# Altium schematic sheet breakout-1.SchDoc
size Letter
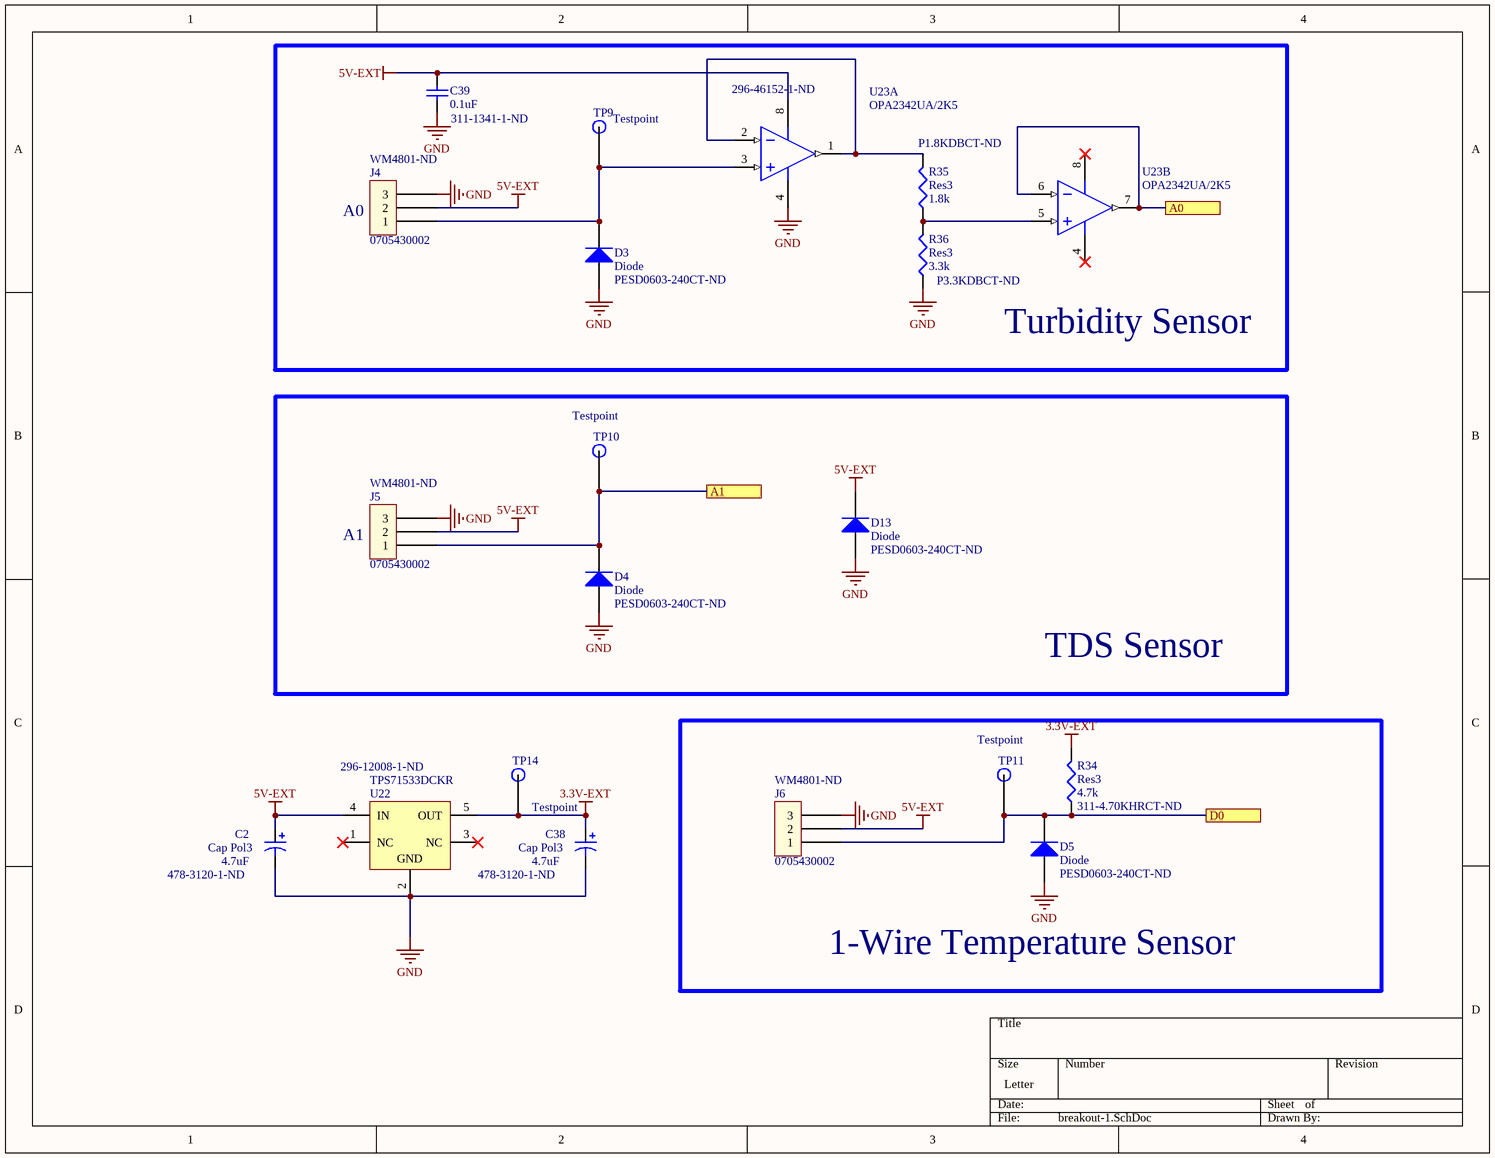
[diagram p0: breakout-1.SchDoc]

## Parts
C2  Cap Pol3  value 4.7uF  Supplier Part Number 1: 478-3120-1-ND  [1206-pol]
C38  Cap Pol3  value 4.7uF  Supplier Part Number 1: 478-3120-1-ND  [1206-pol]
C39  value 0.1uF  Supplier Part Number 1: 311-1341-1-ND  [1608[0603]]  (hidden comment: Cap Semi)
D3  Diode  Supplier Part Number 1: PESD0603-240CT-ND  [J1-0603]
D4  Diode  Supplier Part Number 1: PESD0603-240CT-ND  [J1-0603]
D5  Diode  Supplier Part Number 1: PESD0603-240CT-ND  [J1-0603]
D13  Diode  Supplier Part Number 1: PESD0603-240CT-ND  [J1-0603]
J4  0705430002  Supplier Part Number 1: WM4801-ND  [0705430002]
J5  0705430002  Supplier Part Number 1: WM4801-ND  [0705430002]
J6  0705430002  Supplier Part Number 1: WM4801-ND  [0705430002]
R34  Res3  value 4.7k  Supplier Part Number 1: 311-4.70KHRCT-ND  [J1-0603]
R35  Res3  value 1.8k  Supplier Part Number 1: P1.8KDBCT-ND  [J1-0603]
R36  Res3  value 3.3k  Supplier Part Number 1: P3.3KDBCT-ND  [J1-0603]
TP9  Testpoint  [testpoint]  (no BOM)
TP10  Testpoint  [testpoint]  (no BOM)
TP11  Testpoint  [testpoint]  (no BOM)
TP14  Testpoint  [testpoint]  (no BOM)
U22  TPS71533DCKR  Supplier Part Number 1: 296-12008-1-ND  [DCK0005A_L]
U23  OPA2342UA/2K5  Supplier Part Number 1: 296-46152-1-ND  [D0008A_M]  (parts A,B of 2)

## Blocks framed on the sheet
Turbidity Sensor: C39 D3 J4 R35 R36 TP9 U23
TDS Sensor: D4 D13 J5 TP10
1-Wire Temperature Sensor: D5 J6 R34 TP11

## Ports
A0, A1, D0

## Nets
3.3V-EXT: C38.1 R34.2 TP14.1 U22.5(OUT)
5V-EXT: C2.1 C39.1 D13.2(K) J4.2 J5.2 J6.2 U22.4(IN) U23.8(V+)
GND: C2.2 C38.2 C39.2 D3.1(A) D4.1(A) D5.1(A) D13.1(A) J4.3 J5.3 J6.3 R36.1 U22.2(GND) U23.4(V-)
A0: U23.6(IN_B-) U23.7(OUT_B) ; port A0
A1: D4.2(K) J5.1 TP10.1 ; port A1
D0: D5.2(K) J6.1 R34.1 TP11.1 ; port D0
NetD3_2: D3.2(K) J4.1 TP9.1 U23.3(IN_A+)
NetR35_1: R35.1 R36.2 U23.5(IN_B+)
NetR35_2: R35.2 U23.1(OUT_A) U23.2(IN_A-)

Not connected (* = marked no-connect by the designer): U22 1(NC)* 3(NC)*

## Notes on the sheet
- (near J4) A0
- (near J5) A1

## Library data of the parts
C2 C38 = Cap Pol3: Polarized Capacitor (Surface Mount); Manufacturer: AVX Corporation; Manufacturer Part Number: NOJA475M010RWJ; Manufacturer Size Code: A; Tolerance: ±20%; Dissipation Factor: 6%; Supplier 1: Digi-Key; RoHS: RoHS Compliant; Category: Capacitors; Stock 1: 5356; Pricing 1: 1=0.68, 10=0.485, 100=0.319, 500=0.2363, 1000=0.20086 (CAD); Packaging: Cut Tape (CT); Part Status: Active; Mounting Type: Surface Mount; Package / Case: 1206 (3216 Metric); Height - Seated (Max): 0.071" (1.80mm); Features: -; Operating Temperature: -55°C ~ 105°C; Supplier Device Package: 1206 (3216 Metric); Size / Dimension: 0.126" L x 0.063" W (3.20mm x 1.60mm); ComponentLink1URL: http://datasheets.avx.com/NOJ.pdf; ComponentLink1Description: http://datasheets.avx.com/NOJ.pdf
C39 = Cap Semi: Capacitor (Semiconductor SIM Model); Manufacturer: Yageo; Manufacturer Part Number: CC0603KRX7R8BB104; Capacitance: 100nF; Tolerance: 10%; Voltage Rating: 25V; Dielectric: X7R; ComponentLink1URL: http://www.samsungsem.com/servlet/FileDownload?type=spec&file=CL10B104KB8NNNC.pdf; ComponentLink1Description: http://www.samsungsem.com/servlet/FileDownload?type=spec&file=CL10B104KB8NNNC.pdf; Supplier 1: Digi-Key; Stock 1: 22812167; Pricing 1: 1=0.10000, 10=0.05000, 100=0.02220, 500=0.01584, 1000=0.01245 (USD); RoHS: Yes; Mount: Surface Mount; Case/Package: 0603; Number of Pins: 2; Case Code (Imperial): 0603; Case Code (Metric): 1608; Min Operating Temperature: -55°C; Max Operating Temperature: 125°C; Packaging: Tape and Reel; Package Quantity: 1; Voltage Rating (DC): 25V; Termination: SMD/SMT; Composition: Ceramic; Voltage: 25V; Length: 1.6mm; Height: 0.8mm; Width: 0.8mm; Thickness: 0.035inch; Depth: 0.8mm; Radiation Hardening: No; REACH SVHC: Unknown; Lead Free: Lead Free; Halogen Free: Halogen Free; ComponentLink2URL: https://datasheet.ciiva.com/11786/0900766b80c10176-11786120.pdf?src-supplier=RSComponents; ComponentLink2Description: https://datasheet.ciiva.com/11786/0900766b80c10176-11786120.pdf?src-supplier=RSComponents; ComponentLink3URL: https://datasheet.ciiva.com/144/mlccorderingcode-144075.pdf?src-supplier=Digi-Key; ComponentLink3Description: https://datasheet.ciiva.com/144/mlccorderingcode-144075.pdf?src-supplier=Digi-Key; ComponentLink4URL: https://datasheet.ciiva.com/17434/upy-gphc-x7r-6-3v-to-50v-8-17434263.pdf?src-supplier=Avnet+Europe; ComponentLink4Description: https://datasheet.ciiva.com/17434/upy-gphc-x7r-6-3v-to-50v-8-17434263.pdf?src-supplier=Avnet+Europe; ComponentLink5URL: https://datasheet.ciiva.com/26829/getdatasheetpartid-403577-26829431.pdf?src-supplier=Verical; ComponentLink5Description: https://datasheet.ciiva.com/26829/getdatasheetpartid-403577-26829431.pdf?src-supplier=Verical; ComponentLink6URL: https://datasheet.ciiva.com/11587/upy-gphc-x7r-6-3v-to-50v-8-11587208.pdf?src-supplier=Avnet; ComponentLink6Description: https://datasheet.ciiva.com/11587/upy-gphc-x7r-6-3v-to-50v-8-11587208.pdf?src-supplier=Avnet; ComponentLink7URL: https://datasheet.ciiva.com/13389/upy-gphc-x7r-6-3v-to-50v-8-13389352.pdf?src-supplier=Mouser; ComponentLink7Description: https://datasheet.ciiva.com/13389/upy-gphc-x7r-6-3v-to-50v-8-13389352.pdf?src-supplier=Mouser; ComponentLink8URL: https://datasheet.ciiva.com/28450/1489800-28450584.pdf?src-supplier=Element14; ComponentLink8Description: https://datasheet.ciiva.com/28450/1489800-28450584.pdf?src-supplier=Element14; ComponentLink9URL: https://datasheet.ciiva.com/144/mlccorderingcode-144073.pdf?src-supplier=Digi-Key; ComponentLink9Description: https://datasheet.ciiva.com/144/mlccorderingcode-144073.pdf?src-supplier=Digi-Key; ComponentLink10URL: https://datasheet.ciiva.com/144/mlccorderingcode-144074.pdf?src-supplier=Digi-Key; ComponentLink10Description: https://datasheet.ciiva.com/144/mlccorderingcode-144074.pdf?src-supplier=Digi-Key; ComponentLink11URL: https://datasheet.ciiva.com/7978/1489800-7978155.pdf?src-supplier=Element14; ComponentLink11Description: https://datasheet.ciiva.com/7978/1489800-7978155.pdf?src-supplier=Element14
D3-D5 D13 = Diode: Default Diode; Manufacturer: Littelfuse; Manufacturer Part Number: RF1256-000; Clamping Voltage: 45V; Reverse Standoff Voltage: 24V; Power Line Protection: No; Number of Bidirectional Channels: 1; Published: 8-Jun-2000; LatestRevisionDate: 17-Jul-2002; LatestRevisionNote: Re-released for DXP Platform.; PackageVersion: Sep-1996; PackageReference: SMC; Publisher: Altium Limited; PackageDescription: DO-214-AB/SMC; 2 C-Bend Leads; Body 7.9 x 5.9 mm, inc. leads (LxW); Code_JEDEC: DO-214-AB; Supplier 1: Digi-Key; Stock 1: 74186; Pricing 1: 1 = 0.58000, 10 = 0.45300, 25 = 0.38200, 100 = 0.31080, 250 = 0.25752, 500 = 0.21312, 1000 = 0.15984, 2500 = 0.14652 (USD); RoHS: Yes; Mount: Surface Mount; Case/Package: 0603; Case Code (Metric): 1608; Case Code (Imperial): 0603; Min Operating Temperature: -55°C; Max Operating Temperature: 125°C; Packaging: Tape and Reel; Composition: Zener; ComponentLink1URL: http://www.littelfuse.com/~/media/electronics/datasheets/polymer_esd_suppressors/littelfuse_polymer_esd_suppressor_pesd_catalog_datasheet.pdf.pdf?src-supplier=Digi-Key; ComponentLink1Description: http://www.littelfuse.com/~/media/electronics/datasheets/polymer_esd_suppressors/littelfuse_polymer_esd_suppressor_pesd_catalog_datasheet.pdf.pdf?src-supplier=Digi-Key
J4-J6 = 0705430002: Manufacturer: Molex; Manufacturer Part Number: 70543-0002; Number of Positions: 3; Contact Resistance: 30mR; Gender: Male; Current Rating: 3A; Voltage Rating: 250V; Pitch: 2.54mm; Approvals: UL; Glow Wire Compliant: Non-compliant; Supplier 1: Digi-Key; Stock 1: 32342; Pricing 1: 1 = 0.92000, 10 = 0.80500, 100 = 0.69450, 500 = 0.56826, 2496 = 0.45776, 7488 = 0.44198, 12480 = 0.41041 (USD); RoHS: Yes; Mount: Through Hole; Color: Black; Housing Color: Black; Housing Material: Thermoplastic; Contact Material: Bronze; Contact Plating: Gold; Material: Brass; Min Operating Temperature: -40°C; Max Operating Temperature: 105°C; Number of Rows: 1; Packaging: Rail/Tube; Termination: Solder; Orientation: Vertical; Package Quantity: 2496; Number of Contacts: 3; Max Current Rating: 3A; Max Voltage Rating (AC): 250V; Number of Circuits: 3; Voltage Rating (DC): 250V; Length: 10.17mm; Height: 11.81mm; Depth: 6.6mm; Lead Pitch: 2.54mm; Radiation Hardening: No; REACH SVHC: Unknown; ELV: Compliant; Lead Free: Lead Free; Flammability Rating: UL94 V-0; ComponentLink1URL: https://datasheet.ciiva.com/11747/0900766b80d8d64b-11747399.pdf?src-supplier=RSComponents; ComponentLink1Description: https://datasheet.ciiva.com/11747/0900766b80d8d64b-11747399.pdf?src-supplier=RSComponents; ComponentLink2URL: https://datasheet.ciiva.com/30061/97290705430002-pcb-headers-30061900.pdf?src-supplier=Onlinecomponents.com; ComponentLink2Description: https://datasheet.ciiva.com/30061/97290705430002-pcb-headers-30061900.pdf?src-supplier=Onlinecomponents.com; ComponentLink3URL: https://datasheet.ciiva.com/19462/884643-19462365.pdf?src-supplier=Jameco; ComponentLink3Description: https://datasheet.ciiva.com/19462/884643-19462365.pdf?src-supplier=Jameco; ComponentLink4URL: https://datasheet.ciiva.com/5150/0705430002-pcb-headers-172733-5150622.pdf?src-supplier=Mouser; ComponentLink4Description: https://datasheet.ciiva.com/5150/0705430002-pcb-headers-172733-5150622.pdf?src-supplier=Mouser; ComponentLink5URL: https://datasheet.ciiva.com/16657/0705430002-pcb-headers-16657766.pdf?src-supplier=Avnet+Europe; ComponentLink5Description: https://datasheet.ciiva.com/16657/0705430002-pcb-headers-16657766.pdf?src-supplier=Avnet+Europe
R34 = Res3: Resistor; Manufacturer: Yageo; Manufacturer Part Number: RC0603FR-074K7L; Tolerance: 1%; Resistance: 4.7kR; Temperature Coefficient: 100ppm/°C; Power Rating: 100mW; Voltage Rating (DC): 50V; Published: 8-Jun-2000; LatestRevisionDate: 29-May-2009; LatestRevisionNote: IPC-7351 Footprint Added.; PackageReference: J1-0603; Publisher: Altium Limited; PackageDescription: Chip Resistor; Supplier 1: Digi-Key; Stock 1: 18304102; Pricing 1: 1 = 0.10000, 10 = 0.02400, 100 = 0.00970, 1000 = 0.00437, 2500 = 0.00379 (USD); RoHS: Yes; Case/Package: 0603; Number of Pins: 2; Case Code (Imperial): 0603; Case Code (Metric): 1608; Min Operating Temperature: -55°C; Max Operating Temperature: 155°C; Composition: Thick Film; Packaging: Tape and Reel; Voltage Rating: 50V; Termination: SMD/SMT; Military Standard: Not; Length: 1.6mm; Height: 0.45mm; Width: 0.8mm; Depth: 0.8mm; Lead Pitch: 0.3mm; REACH SVHC: No SVHC; Lead Free: Lead Free; ComponentLink1URL: https://datasheet.ciiva.com/15189/getdatasheetpartid-422754-15189760.pdf?src-supplier=Verical; ComponentLink1Description: https://datasheet.ciiva.com/15189/getdatasheetpartid-422754-15189760.pdf?src-supplier=Verical; ComponentLink2URL: https://datasheet.ciiva.com/22747/443971-22747528.pdf?src-supplier=Element14; ComponentLink2Description: https://datasheet.ciiva.com/22747/443971-22747528.pdf?src-supplier=Element14; ComponentLink3URL: https://datasheet.ciiva.com/7660/38590-7660794.pdf?src-supplier=Element14; ComponentLink3Description: https://datasheet.ciiva.com/7660/38590-7660794.pdf?src-supplier=Element14; ComponentLink4URL: https://datasheet.ciiva.com/7746/1868787-7746365.pdf?src-supplier=Element14; ComponentLink4Description: https://datasheet.ciiva.com/7746/1868787-7746365.pdf?src-supplier=Element14; ComponentLink5URL: https://datasheet.ciiva.com/46440/1868787-46440909.pdf?src-supplier=Element14; ComponentLink5Description: https://datasheet.ciiva.com/46440/1868787-46440909.pdf?src-supplier=Element14; ComponentLink6URL: https://datasheet.ciiva.com/7746/1738695-7746366.pdf?src-supplier=Element14; ComponentLink6Description: https://datasheet.ciiva.com/7746/1738695-7746366.pdf?src-supplier=Element14
R35 = Res3: Resistor; Manufacturer: Panasonic; Manufacturer Part Number: ERA3AEB182V; Resistance: 1.8kR; Power Rating: 100mW; Tolerance: 0.1%; Voltage Rating: 75V; Temperature Coefficient: 25ppm/°C; Published: 8-Jun-2000; LatestRevisionDate: 29-May-2009; LatestRevisionNote: IPC-7351 Footprint Added.; PackageReference: J1-0603; Publisher: Altium Limited; PackageDescription: Chip Resistor; Supplier 1: Digi-Key; Stock 1: 69670; Pricing 1: 1=0.35000, 10=0.30000, 100=0.11720, 1000=0.04906, 2500=0.04498 (USD); RoHS: Yes; Mount: Surface Mount; Case/Package: 0603; Number of Pins: 2; Case Code (Metric): 1608; Case Code (Imperial): 0603; Contact Plating: Tin; Min Operating Temperature: -55°C; Max Operating Temperature: 155°C; Packaging: Tape and Reel; Package Quantity: 1; Composition: Thin Film; Termination: SMD/SMT; Number of Terminations: 2; Military Standard: Not; Max Power Dissipation: 100mW; Voltage Rating (DC): 75V; Features: Automotive AEC-Q200; Length: 1.6mm; Height: 0.022inch; Width: 0.031inch; Depth: 0.8mm; Radiation Hardening: No; REACH SVHC: No SVHC; Lead Free: Lead Free; ComponentLink1URL: https://datasheet.ciiva.com/11808/0900766b80fe20f7-11808057.pdf?src-supplier=RSComponents; ComponentLink1Description: https://datasheet.ciiva.com/11808/0900766b80fe20f7-11808057.pdf?src-supplier=RSComponents; ComponentLink2URL: https://datasheet.ciiva.com/29183/450862-da-01-en-widerstand-0603-era-29183768.pdf?src-supplier=Conrad; ComponentLink2Description: https://datasheet.ciiva.com/29183/450862-da-01-en-widerstand-0603-era-29183768.pdf?src-supplier=Conrad; ComponentLink3URL: https://datasheet.ciiva.com/6000/485442-6000901.pdf?src-supplier=Farnell; ComponentLink3Description: https://datasheet.ciiva.com/6000/485442-6000901.pdf?src-supplier=Farnell; ComponentLink4URL: https://datasheet.ciiva.com/48425/era-eng-tds-48425432.pdf?src-supplier=Distrelec; ComponentLink4Description: https://datasheet.ciiva.com/48425/era-eng-tds-48425432.pdf?src-supplier=Distrelec; ComponentLink5URL: https://datasheet.ciiva.com/17214/aoa0000ce26-17214494.pdf?src-supplier=Avnet+Europe; ComponentLink5Description: https://datasheet.ciiva.com/17214/aoa0000ce26-17214494.pdf?src-supplier=Avnet+Europe; ComponentLink6URL: https://datasheet.ciiva.com/9197/aoa0000ce26-9197737.pdf?src-supplier=Avnet; ComponentLink6Description: https://datasheet.ciiva.com/9197/aoa0000ce26-9197737.pdf?src-supplier=Avnet; ComponentLink7URL: https://datasheet.ciiva.com/46422/485442-46422587.pdf?src-supplier=Element14; ComponentLink7Description: https://datasheet.ciiva.com/46422/485442-46422587.pdf?src-supplier=Element14; ComponentLink8URL: https://datasheet.ciiva.com/30218/54aoa0000ce26-30218060.pdf?src-supplier=Onlinecomponents.com; ComponentLink8Description: https://datasheet.ciiva.com/30218/54aoa0000ce26-30218060.pdf?src-supplier=Onlinecomponents.com; ComponentLink9URL: https://datasheet.ciiva.com/46422/485442-46422588.pdf?src-supplier=Element14; ComponentLink9Description: https://datasheet.ciiva.com/46422/485442-46422588.pdf?src-supplier=Element14; ComponentLink10URL: https://datasheet.ciiva.com/43455/485442-43455222.pdf?src-supplier=Farnell; ComponentLink10Description: https://datasheet.ciiva.com/43455/485442-43455222.pdf?src-supplier=Farnell; ComponentLink11URL: https://datasheet.ciiva.com/46422/485442-46422589.pdf?src-supplier=Element14; ComponentLink11Description: https://datasheet.ciiva.com/46422/485442-46422589.pdf?src-supplier=Element14
R36 = Res3: Resistor; Manufacturer: Panasonic; Manufacturer Part Number: ERA-3AEB332V; Tolerance: 0.1%; Resistance: 3.3kR; Temperature Coefficient: 25ppm/°C; Power Rating: 100mW; Voltage Rating: 75V; Published: 8-Jun-2000; LatestRevisionDate: 29-May-2009; LatestRevisionNote: IPC-7351 Footprint Added.; PackageReference: J1-0603; Publisher: Altium Limited; PackageDescription: Chip Resistor; Supplier 1: Digi-Key; Stock 1: 140800; Pricing 1: 1=0.35000, 10=0.30000, 100=0.11720, 1000=0.04906, 2500=0.04498 (USD); RoHS: Yes; Mount: Surface Mount; Case/Package: 0603; Number of Pins: 2; Contact Plating: Tin; Case Code (Imperial): 0603; Case Code (Metric): 1608; Min Operating Temperature: -55°C; Max Operating Temperature: 155°C; Composition: Metal Film; Packaging: Tape and Reel; Package Quantity: 1; Termination: SMD/SMT; Number of Terminations: 2; Military Standard: Not; Max Power Dissipation: 100mW; Voltage Rating (DC): 75V; Features: Automotive AEC-Q200; Length: 1.6mm; Height: 0.45mm; Width: 0.8mm; Depth: 0.8mm; Radiation Hardening: No; REACH SVHC: No SVHC; Lead Free: Lead Free; ComponentLink1URL: https://datasheet.ciiva.com/11808/0900766b80fe20f7-11808044.pdf?src-supplier=RSComponents; ComponentLink1Description: https://datasheet.ciiva.com/11808/0900766b80fe20f7-11808044.pdf?src-supplier=RSComponents; ComponentLink2URL: https://datasheet.ciiva.com/29183/450962-da-01-en-widerstand-0603-era-29183781.pdf?src-supplier=Conrad; ComponentLink2Description: https://datasheet.ciiva.com/29183/450962-da-01-en-widerstand-0603-era-29183781.pdf?src-supplier=Conrad; ComponentLink3URL: https://datasheet.ciiva.com/16783/70068849-16783127.pdf?src-supplier=Allied+Electronics; ComponentLink3Description: https://datasheet.ciiva.com/16783/70068849-16783127.pdf?src-supplier=Allied+Electronics; ComponentLink4URL: https://datasheet.ciiva.com/46397/485442-46397447.pdf?src-supplier=Element14; ComponentLink4Description: https://datasheet.ciiva.com/46397/485442-46397447.pdf?src-supplier=Element14; ComponentLink5URL: https://datasheet.ciiva.com/46397/485442-46397448.pdf?src-supplier=Element14; ComponentLink5Description: https://datasheet.ciiva.com/46397/485442-46397448.pdf?src-supplier=Element14; ComponentLink6URL: https://datasheet.ciiva.com/43455/485442-43455225.pdf?src-supplier=Farnell; ComponentLink6Description: https://datasheet.ciiva.com/43455/485442-43455225.pdf?src-supplier=Farnell; ComponentLink7URL: https://datasheet.ciiva.com/9196/aoa0000ce26-9196554.pdf?src-supplier=Avnet; ComponentLink7Description: https://datasheet.ciiva.com/9196/aoa0000ce26-9196554.pdf?src-supplier=Avnet; ComponentLink8URL: https://datasheet.ciiva.com/16395/aoa0000ce26-16395258.pdf?src-supplier=Future+Electronics; ComponentLink8Description: https://datasheet.ciiva.com/16395/aoa0000ce26-16395258.pdf?src-supplier=Future+Electronics; ComponentLink9URL: https://datasheet.ciiva.com/16785/70068849-16785020.pdf?src-supplier=Allied+Electronics; ComponentLink9Description: https://datasheet.ciiva.com/16785/70068849-16785020.pdf?src-supplier=Allied+Electronics; ComponentLink10URL: https://datasheet.ciiva.com/30210/54aoa0000ce26-30210940.pdf?src-supplier=Onlinecomponents.com; ComponentLink10Description: https://datasheet.ciiva.com/30210/54aoa0000ce26-30210940.pdf?src-supplier=Onlinecomponents.com; ComponentLink11URL: https://datasheet.ciiva.com/6137/485442-6137949.pdf?src-supplier=Farnell; ComponentLink11Description: https://datasheet.ciiva.com/6137/485442-6137949.pdf?src-supplier=Farnell; ComponentLink12URL: https://datasheet.ciiva.com/43457/485442-43457774.pdf?src-supplier=Farnell; ComponentLink12Description: https://datasheet.ciiva.com/43457/485442-43457774.pdf?src-supplier=Farnell; ComponentLink13URL: https://datasheet.ciiva.com/48530/era-eng-tds-48530478.pdf?src-supplier=Distrelec; ComponentLink13Description: https://datasheet.ciiva.com/48530/era-eng-tds-48530478.pdf?src-supplier=Distrelec
TP9-TP11 TP14 = SMT Testpoint
U22 = CMP-0394-00925-2: Single Output LDO, 50 mA, Fixed 3.3 V Output, 3 to 24 V Input, 5-pin SC70 (DCK), -40 to 85 degC, Green (RoHS & no Sb/Br); Manufacturer: Texas Instruments; Accuracy(%): 4; Vdo(Typ)(mV): 415; Vin(Min)(V): 3; Iq(Typ)(mA): 0.003; Fixed Output Options(V): 3.3; SubFamily: Single Channel LDO; Iout(Max)(A): 0.05; Vin(Max)(V): 24; Dropout Voltage: 415mV; Output Current: 50mA; Number of Outputs: 1; Output Voltage: 3.3V; Max Power Dissipation: 320mW; Max Input Voltage: 24V; Min Input Voltage: 3V; Min Current Limit: 125mA; Input Bias Current: 3.2uA; Polarity: Positive; Quiescent Current: 3uA; Accuracy: 4%; Min Supply Voltage: 2.5V; ComponentLink3Description: Package Specification; ComponentLink1URL: http://www.ti.com/; ComponentLink3URL: http://www.ti.com/litv/pdf/mpds025f; PackageDescription: 5-Pin Plastic Small-Outline, Body 2 x 1.25 mm, Pitch 0.65 mm; PartNumber: TPS71533DCKR; Vout Adj(Min)(V): 3.3; ComponentLink2URL: http://www.ti.com/general/docs/lit/getliterature.tsp?genericPartNumber=TPS71533&fileType=pdf; ComponentLink2Description: Datasheet; ComponentLink1Description: Manufacturer URL; Code_JEDEC: MO-203; Vout Adj(Max)(V): 3.3; Mounting Technology: Surface Mount; DatasheetVersion: SLVS338P; Eco-Plan: Green (RoHS & no Sb/Br); PackageVersion: 4093553-3/G; PackageReference: DCK0005A; Supplier 1: Digi-Key; Manufacturer Part Number: TPS71533DCKR; Stock 1: 159612; Pricing 1: 1 = 0.90000, 10 = 0.80200, 100 = 0.62540, 500 = 0.51664, 1000 = 0.40788 (USD); RoHS: Yes; Case/Package: SC; Number of Pins: 5; Min Operating Temperature: -40°C; Max Operating Temperature: 125°C; Package Quantity: 3000; Packaging: Tape and Reel; Power Rating: 320mW; Max Output Current: 50mA; Number of Regulators: 1; Min Output Voltage: 3.3V; Power Dissipation: 320mW; Output Voltage Accuracy: 4%; Max Output Voltage: 3.3V; Output Type: Fixed; Nominal Output Voltage: 3.3V; Termination: SMD/SMT; Current Rating: 50mA; Length: 2mm; Height: 0.9mm; Width: 1.25mm; Radiation Hardening: No; Lead Free: Lead Free; REACH SVHC: No SVHC; ComponentLink4URL: https://datasheet.ciiva.com/22700/1835023-22700176.pdf?src-supplier=Element14; ComponentLink4Description: https://datasheet.ciiva.com/22700/1835023-22700176.pdf?src-supplier=Element14; ComponentLink5URL: https://datasheet.ciiva.com/27051/1116751-27051464.pdf?src-supplier=Jameco; ComponentLink5Description: https://datasheet.ciiva.com/27051/1116751-27051464.pdf?src-supplier=Jameco; ComponentLink6URL: https://datasheet.ciiva.com/7992/1854688-7992972.pdf?src-supplier=Element14; ComponentLink6Description: https://datasheet.ciiva.com/7992/1854688-7992972.pdf?src-supplier=Element14
U23 = CMP-0272-00490-3: Low Cost, Low Power, Rail-to-Rail Operational Amplifier MicroAmplifier(TM) Series, 2.7 to 5.5 V, -40 to 85 degC, 8-pin SOIC (D8), Green (RoHS & no Sb/Br); Manufacturer: Texas Instruments; Vio (25C)(Max)(mV): 6; Total Supply Voltage(Min)(+5V is 5, +/-5V is 10): 2.7; Number of Channels: 2; CMRR(Min)(dB): 74; Iq per channel(Max)(mA): 0.25; Rating: Catalog; Packing: LARGE T&R; Sub Family: Low Input Bias Current Amp (<=10pA), Low Power Amp (<=500uA), Low Supply Voltage Amplifier (<=2.7V), Precision Amplifier; Total Supply Voltage(Max)(+5V is 5, +/-5V is 10): 5.5; Offset Drift(Typ)(uV/C): 3; IIB(Max)(pA): 10; GBW(Typ)(MHz): 1; Min Supply Voltage: 2.7V; Max Supply Voltage: 5.5V; Voltage Gain: 124dB; Unity Gain Bandwidth Product: 1MHz; Nominal Supply Current: 500uA; Common Mode Rejection Ratio: 74dB; Max I/O Voltage: 6mV; Input Bias Current: 10pA; Power Supply Rejection Ratio (PSRR): 90.46dB; DatasheetVersion: SBOS106A; PackageReference: D0008A; ComponentLink3URL: http://www.ti.com/litv/pdf/msoi002j; ComponentLink1URL: http://www.ti.com/; ComponentLink2URL: http://www.ti.com/lit/ds/symlink/opa2342.pdf; PartNumber: OPA2342UA/2K5; ComponentLink2Description: Datasheet; PackageDescription: 8-Pin Plastic Small Outline, Body 4.9 x 3.9 mm, Pitch 1.27 mm; ComponentLink3Description: Package Specification; Code_JEDEC: MS-012; ComponentLink1Description: Manufacturer URL; PackageVersion: 4040047-3/M, 06/2011; Mounting Technology: Surface Mount; Slew Rate(Typ)(V/us): 1; Eco-Plan: Green (RoHS & no Sb/Br); Supplier 1: Digi-Key; Manufacturer Part Number: OPA2342UA/2K5; Stock 1: 2557; Pricing 1: 1=1.64000, 10=1.47100, 100=1.18250, 500=0.97154, 1000=0.80500 (USD); Case/Package: D; Number of Pins: 8; Min Operating Temperature: -40°C; Max Operating Temperature: 85°C; Packaging: Tape and Reel; Package Quantity: 2500; Nominal Gain Bandwidth Product: 1MHz; Number of Circuits: 2; Input Offset Voltage (Vos): 6mV; Gain Bandwidth Product: 1MHz; Number of Elements: 2; Bandwidth: 1MHz; Radiation Hardening: No; Lead Free: Lead Free; ComponentLink4URL: https://datasheet.ciiva.com/1812/opa4342-1812892.pdf?src-supplier=Digi-Key; ComponentLink4Description: https://datasheet.ciiva.com/1812/opa4342-1812892.pdf?src-supplier=Digi-Key